# Altium schematic sheet ESP32 Sheet.SchDoc
size A2; SheetNumber: 1; SheetTotal: 1
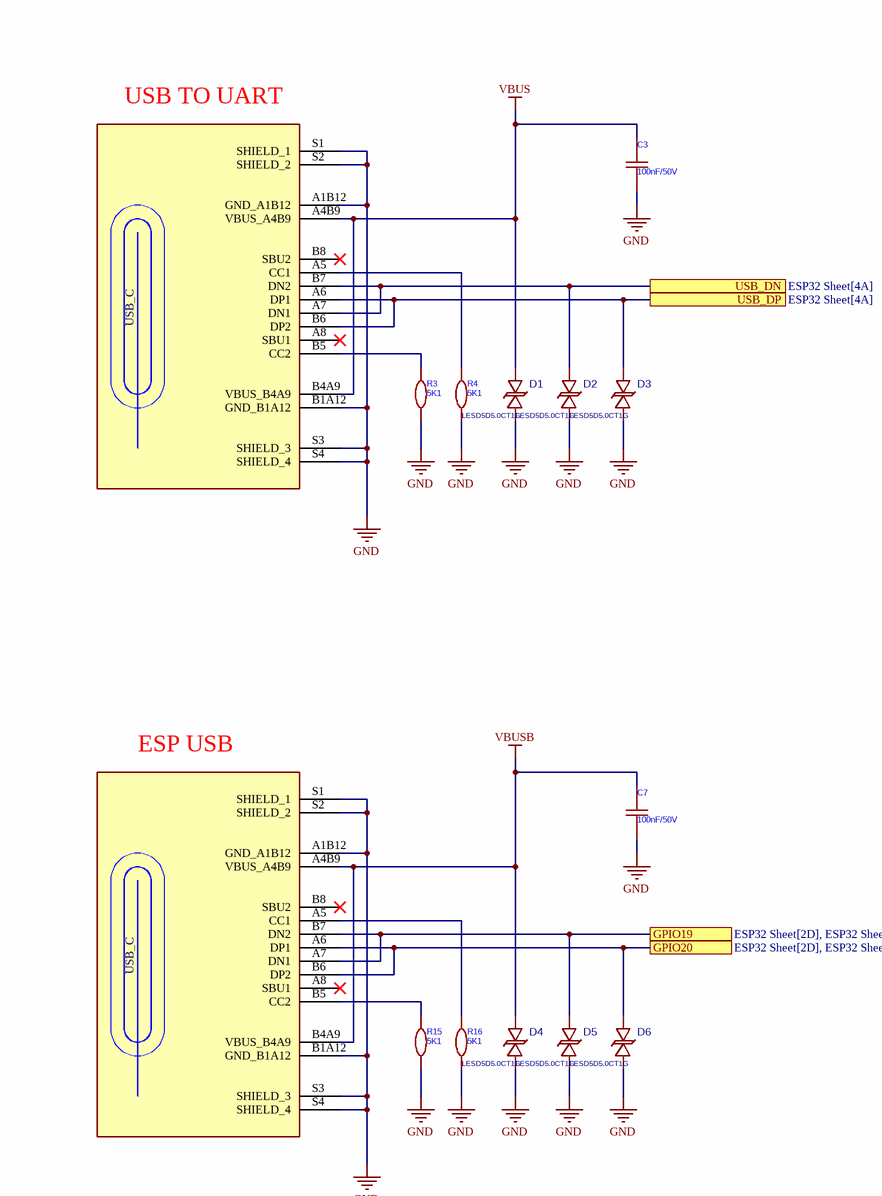
[diagram p0: ESP32 Sheet.SchDoc, top left]
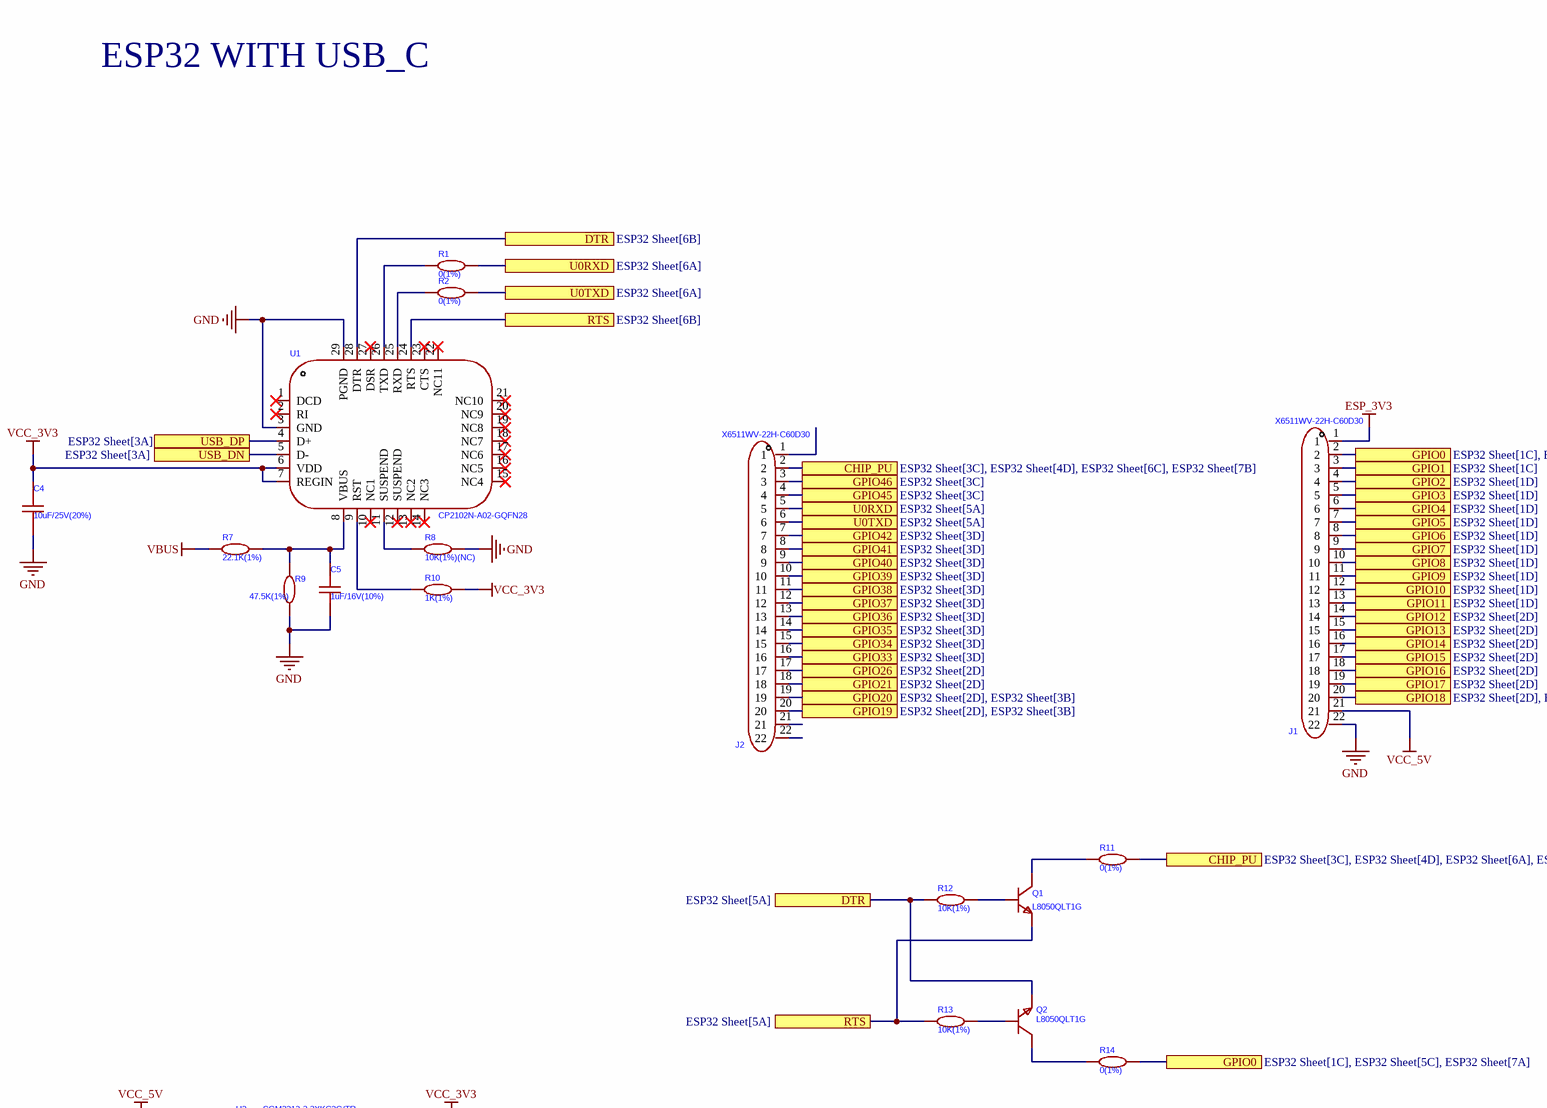
[diagram p1: ESP32 Sheet.SchDoc, top right]
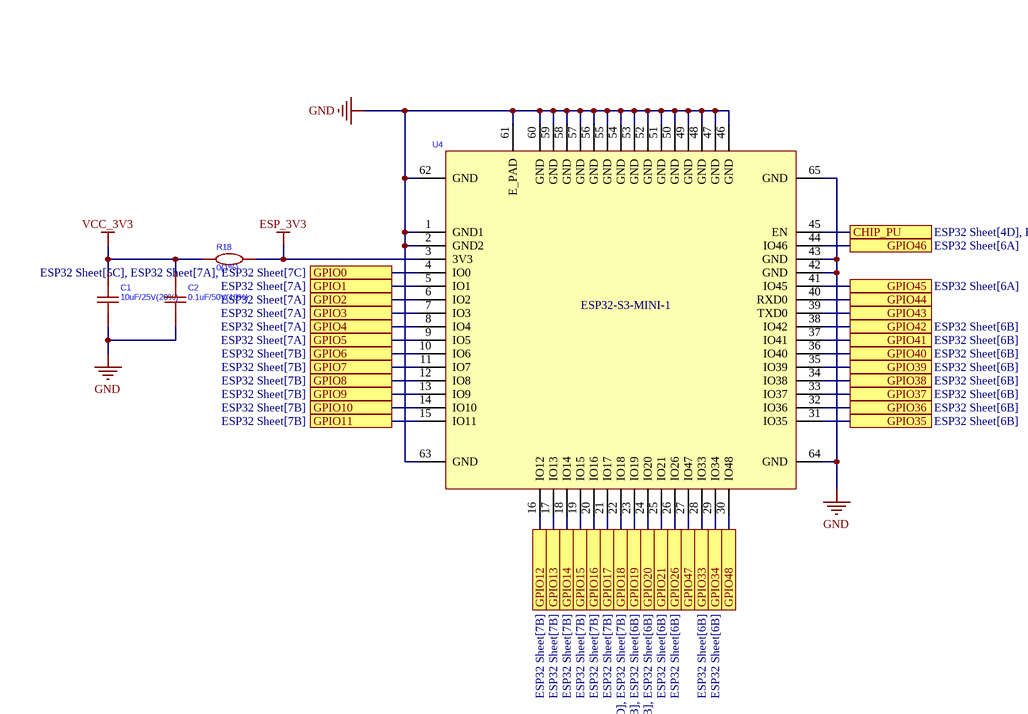
[diagram p2: ESP32 Sheet.SchDoc, bottom left]
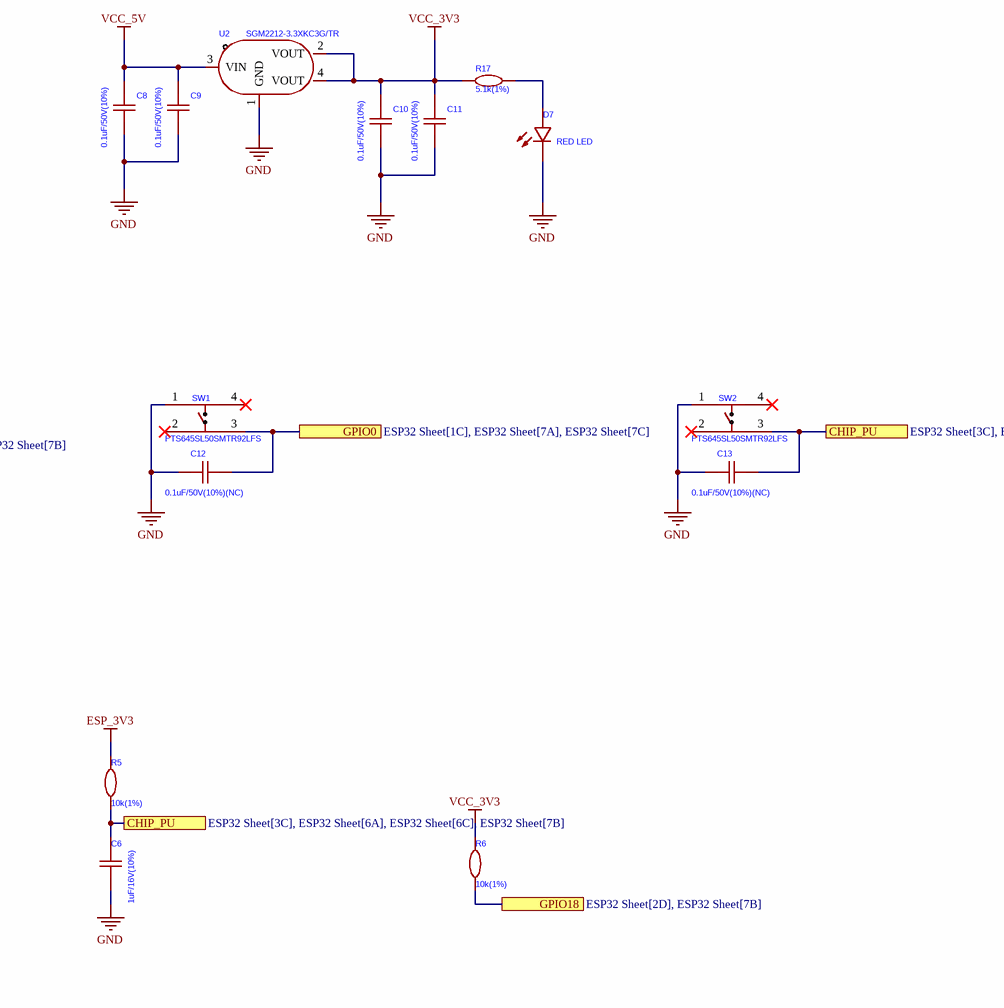
[diagram p3: ESP32 Sheet.SchDoc, bottom right]

## Parts
C1  10uF/25V(20%)  [C0402]
C2  0.1uF/50V(10%)  [C0402]
C3  100nF/50V  [C0402]
C4  10uF/25V(20%)  [C0402]
C5  1uF/16V(10%)  [C0402]
C6  1uF/16V(10%)  [C0402]
C7  100nF/50V  [C0402]
C8  0.1uF/50V(10%)  [C0402]
C9  0.1uF/50V(10%)  [C0402]
C10  0.1uF/50V(10%)  [C0402]
C11  0.1uF/50V(10%)  [C0402]
C12  0.1uF/50V(10%)(NC)  [C0402]
C13  0.1uF/50V(10%)(NC)  [C0402]
D1  LESD5D5.0CT1G  [SOD-523_L1.2-W0.8-LS1.6-BI]
D2  LESD5D5.0CT1G  [SOD-523_L1.2-W0.8-LS1.6-BI]
D3  LESD5D5.0CT1G  [SOD-523_L1.2-W0.8-LS1.6-BI]
D4  LESD5D5.0CT1G  [SOD-523_L1.2-W0.8-LS1.6-BI]
D5  LESD5D5.0CT1G  [SOD-523_L1.2-W0.8-LS1.6-BI]
D6  LESD5D5.0CT1G  [SOD-523_L1.2-W0.8-LS1.6-BI]
D7  RED LED  [LED0402-R-RD]
J1  X6511WV-22H-C60D30  [HDR-TH_22P-P2.54-V-M]
J2  X6511WV-22H-C60D30  [HDR-TH_22P-P2.54-V-M]
Q1  L8050QLT1G  [SOT-23-3_L2.9-W1.3-P1.90-LS2.4-BR]
Q2  L8050QLT1G  [SOT-23-3_L2.9-W1.3-P1.90-LS2.4-BR]
R1  0(1%)  [R0402]
R2  0(1%)  [R0402]
R3  5K1  [R0402]
R4  5K1  [R0402]
R5  10k(1%)  [R0402]
R6  10k(1%)  [R0402]
R7  22.1K(1%)  [R0402]
R8  10K(1%)(NC)  [R0402]
R9  47.5K(1%)  [R0402]
R10  1K(1%)  [R0402]
R11  0(1%)  [R0402]
R12  10K(1%)  [R0402]
R13  10K(1%)  [R0402]
R14  0(1%)  [R0402]
R15  5K1  [R0402]
R16  5K1  [R0402]
R17  5.1k(1%)  [R0402]
R18  0(1%)  [R0402]
SW1  PTS645SL50SMTR92LFS  [KEY-SMD_4P-L6.0-W6.0-P4.50-LS9.0]
SW2  PTS645SL50SMTR92LFS  [KEY-SMD_4P-L6.0-W6.0-P4.50-LS9.0]
U1  CP2102N-A02-GQFN28  [QFN-28_L5.0-W5.0-P0.50-TL-EP3.3]
U2  SGM2212-3.3XKC3G/TR  [SOT-223-3_L6.5-W3.4-P2.30-LS7.0-BR]
U4  2.4GHz  [BULETM-SMD_ESP32-S3-MINI-1-N8]  (value not drawn)
USB1  2171790001  [USB-C-SMD_2171790001]  (value not drawn)
USB2  2171790001  [USB-C-SMD_2171790001]  (value not drawn)

## Ports
CHIP_PU (see ESP32 Sheet[3C], ESP32 Sheet[4D], ESP32 Sheet[6A], ESP32 Sheet[6C]), CHIP_PU (see ESP32 Sheet[3C], ESP32 Sheet[4D], ESP32 Sheet[6A], ESP32 Sheet[7B]), CHIP_PU (see ESP32 Sheet[3C], ESP32 Sheet[4D], ESP32 Sheet[6C], ESP32 Sheet[7B]), CHIP_PU (see ESP32 Sheet[3C], ESP32 Sheet[6A], ESP32 Sheet[6C], ESP32 Sheet[7B]), CHIP_PU (see ESP32 Sheet[4D], ESP32 Sheet[6A], ESP32 Sheet[6C], ESP32 Sheet[7B]), DTR (see ESP32 Sheet[5A]), DTR (see ESP32 Sheet[6B]), GPIO0 (see ESP32 Sheet[1C], ESP32 Sheet[5C], ESP32 Sheet[7A]), GPIO0 (see ESP32 Sheet[1C], ESP32 Sheet[5C], ESP32 Sheet[7C]), GPIO0 (see ESP32 Sheet[1C], ESP32 Sheet[7A], ESP32 Sheet[7C]), GPIO0 (see ESP32 Sheet[5C], ESP32 Sheet[7A], ESP32 Sheet[7C]), GPIO1 (see ESP32 Sheet[1C]), GPIO1 (see ESP32 Sheet[7A]), GPIO2 (see ESP32 Sheet[1D]), GPIO2 (see ESP32 Sheet[7A]), GPIO3 (see ESP32 Sheet[1D]), GPIO3 (see ESP32 Sheet[7A]), GPIO4 (see ESP32 Sheet[1D]), GPIO4 (see ESP32 Sheet[7A]), GPIO5 (see ESP32 Sheet[1D]), GPIO5 (see ESP32 Sheet[7A]), GPIO6 (see ESP32 Sheet[1D]), GPIO6 (see ESP32 Sheet[7B]), GPIO7 (see ESP32 Sheet[1D]), GPIO7 (see ESP32 Sheet[7B]), GPIO8 (see ESP32 Sheet[1D]), GPIO8 (see ESP32 Sheet[7B]), GPIO9 (see ESP32 Sheet[1D]), GPIO9 (see ESP32 Sheet[7B]), GPIO10 (see ESP32 Sheet[1D]), GPIO10 (see ESP32 Sheet[7B]), GPIO11 (see ESP32 Sheet[1D]), GPIO11 (see ESP32 Sheet[7B]), GPIO12 (see ESP32 Sheet[2D]), GPIO12 (see ESP32 Sheet[7B]), GPIO13 (see ESP32 Sheet[2D]), GPIO13 (see ESP32 Sheet[7B]), GPIO14 (see ESP32 Sheet[2D]), GPIO14 (see ESP32 Sheet[7B]), GPIO15 (see ESP32 Sheet[2D]), GPIO15 (see ESP32 Sheet[7B]), GPIO16 (see ESP32 Sheet[2D]), GPIO16 (see ESP32 Sheet[7B]), GPIO17 (see ESP32 Sheet[2D]), GPIO17 (see ESP32 Sheet[7B]), GPIO18 (see ESP32 Sheet[2D], ESP32 Sheet[5D]), GPIO18 (see ESP32 Sheet[2D], ESP32 Sheet[7B]), GPIO18 (see ESP32 Sheet[5D], ESP32 Sheet[7B]), GPIO19 (see ESP32 Sheet[2D], ESP32 Sheet[3B]), GPIO19 (see ESP32 Sheet[2D], ESP32 Sheet[6B]), GPIO19 (see ESP32 Sheet[3B], ESP32 Sheet[6B]), GPIO20 (see ESP32 Sheet[2D], ESP32 Sheet[3B]), GPIO20 (see ESP32 Sheet[2D], ESP32 Sheet[6B]), GPIO20 (see ESP32 Sheet[3B], ESP32 Sheet[6B]), GPIO21 (see ESP32 Sheet[2D]), GPIO21 (see ESP32 Sheet[6B]), GPIO26 (see ESP32 Sheet[2D]), GPIO26 (see ESP32 Sheet[6B]), GPIO33 (see ESP32 Sheet[3D]), GPIO33 (see ESP32 Sheet[6B]), GPIO34 (see ESP32 Sheet[3D]), GPIO34 (see ESP32 Sheet[6B]), GPIO35 (see ESP32 Sheet[3D]), GPIO35 (see ESP32 Sheet[6B]), GPIO36 (see ESP32 Sheet[3D]), GPIO36 (see ESP32 Sheet[6B]), GPIO37 (see ESP32 Sheet[3D]), GPIO37 (see ESP32 Sheet[6B]), GPIO38 (see ESP32 Sheet[3D]), GPIO38 (see ESP32 Sheet[6B]), GPIO39 (see ESP32 Sheet[3D]), GPIO39 (see ESP32 Sheet[6B]), GPIO40 (see ESP32 Sheet[3D]), GPIO40 (see ESP32 Sheet[6B]), GPIO41 (see ESP32 Sheet[3D]), GPIO41 (see ESP32 Sheet[6B]), GPIO42 (see ESP32 Sheet[3D]), GPIO42 (see ESP32 Sheet[6B]), GPIO43, GPIO44, GPIO45 (see ESP32 Sheet[3C]), GPIO45 (see ESP32 Sheet[6A]), GPIO46 (see ESP32 Sheet[3C]), GPIO46 (see ESP32 Sheet[6A]), GPIO47, GPIO48, RTS (see ESP32 Sheet[5A]), RTS (see ESP32 Sheet[6B]), U0RXD (see ESP32 Sheet[5A]), U0RXD (see ESP32 Sheet[6A]), U0TXD (see ESP32 Sheet[5A]), U0TXD (see ESP32 Sheet[6A]), USB_DN (see ESP32 Sheet[3A]), USB_DN (see ESP32 Sheet[4A]), USB_DP (see ESP32 Sheet[3A]), USB_DP (see ESP32 Sheet[4A])

## Nets
ESP_3V3: J1.1 R5.2 R18.1 U4.3(3V3)
GND: C1.1 C2.1 C3.2 C4.2 C5.2 C6.2 C7.2 C8.1 C9.1 C10.1 C11.1 C12.1 C13.1 D1.1 D2.1 D3.1 D4.1 D5.1 D6.1 D7.2(-) J1.22 R3.1 R4.1 R8.1 R9.1 R15.1 R16.1 SW1.1 SW2.1 U1.3(GND) U1.29(PGND) U2.1(GND) U4.1(GND1) U4.2(GND2) U4.42(GND) U4.43(GND) U4.46(GND) U4.47(GND) U4.48(GND) U4.49(GND) U4.50(GND) U4.51(GND) U4.52(GND) U4.53(GND) U4.54(GND) U4.55(GND) U4.56(GND) U4.57(GND) U4.58(GND) U4.59(GND) U4.60(GND) U4.61(E_PAD) U4.62(GND) U4.63(GND) U4.64(GND) U4.65(GND) USB1.A1B12(GND_A1B12) USB1.B1A12(GND_B1A12) USB1.S1(SHIELD_1) USB1.S2(SHIELD_2) USB1.S3(SHIELD_3) USB1.S4(SHIELD_4) USB2.A1B12(GND_A1B12) USB2.B1A12(GND_B1A12) USB2.S1(SHIELD_1) USB2.S2(SHIELD_2) USB2.S3(SHIELD_3) USB2.S4(SHIELD_4)
VBUS: C3.1 D1.2 R7.2 USB1.A4B9(VBUS_A4B9) USB1.B4A9(VBUS_B4A9)
VBUSB: C7.1 D4.2 USB2.A4B9(VBUS_A4B9) USB2.B4A9(VBUS_B4A9)
VCC_3V3: C1.2 C2.2 C4.1 C10.2 C11.2 R6.2 R10.1 R17.2 R18.2 U1.6(VDD) U1.7(REGIN) U2.2(VOUT) U2.4(VOUT)
VCC_5V: C8.2 C9.2 J1.21 U2.3(VIN)
CHIP_PU: C6.1 C13.2 J2.2 R5.1 R11.1 SW2.3 U4.45(EN) ; port CHIP_PU
DTR: Q2.2(E) R12.2 U1.28(DTR) ; port DTR
GPIO0: C12.2 J1.2 R14.1 SW1.3 U4.4(IO0) ; port GPIO0
GPIO1: J1.3 U4.5(IO1) ; port GPIO1
GPIO2: J1.4 U4.6(IO2) ; port GPIO2
GPIO3: J1.5 U4.7(IO3) ; port GPIO3
GPIO4: J1.6 U4.8(IO4) ; port GPIO4
GPIO5: J1.7 U4.9(IO5) ; port GPIO5
GPIO6: J1.8 U4.10(IO6) ; port GPIO6
GPIO7: J1.9 U4.11(IO7) ; port GPIO7
GPIO8: J1.10 U4.12(IO8) ; port GPIO8
GPIO9: J1.11 U4.13(IO9) ; port GPIO9
GPIO10: J1.12 U4.14(IO10) ; port GPIO10
GPIO11: J1.13 U4.15(IO11) ; port GPIO11
GPIO12: J1.14 U4.16(IO12) ; port GPIO12
GPIO13: J1.15 U4.17(IO13) ; port GPIO13
GPIO14: J1.16 U4.18(IO14) ; port GPIO14
GPIO15: J1.17 U4.19(IO15) ; port GPIO15
GPIO16: J1.18 U4.20(IO16) ; port GPIO16
GPIO17: J1.19 U4.21(IO17) ; port GPIO17
GPIO18: J1.20 R6.1 U4.22(IO18) ; port GPIO18
GPIO19: D5.2 J2.20 U4.23(IO19) USB2.A7(DN1) USB2.B7(DN2) ; port GPIO19
GPIO20: D6.2 J2.19 U4.24(IO20) USB2.A6(DP1) USB2.B6(DP2) ; port GPIO20
GPIO21: J2.18 U4.25(IO21) ; port GPIO21
GPIO26: J2.17 U4.26(IO26) ; port GPIO26
GPIO33: J2.16 U4.28(IO33) ; port GPIO33
GPIO34: J2.15 U4.29(IO34) ; port GPIO34
GPIO35: J2.14 U4.31(IO35) ; port GPIO35
GPIO36: J2.13 U4.32(IO36) ; port GPIO36
GPIO37: J2.12 U4.33(IO37) ; port GPIO37
GPIO38: J2.11 U4.34(IO38) ; port GPIO38
GPIO39: J2.10 U4.35(IO39) ; port GPIO39
GPIO40: J2.9 U4.36(IO40) ; port GPIO40
GPIO41: J2.8 U4.37(IO41) ; port GPIO41
GPIO42: J2.7 U4.38(IO42) ; port GPIO42
GPIO43: U4.39(TXD0) ; port GPIO43
GPIO44: U4.40(RXD0) ; port GPIO44
GPIO45: J2.4 U4.41(IO45) ; port GPIO45
GPIO46: J2.3 U4.44(IO46) ; port GPIO46
GPIO47: U4.27(IO47) ; port GPIO47
GPIO48: U4.30(IO48) ; port GPIO48
RTS: Q1.2(E) R13.2 U1.24(RTS) ; port RTS
U0RXD: J2.5 R1.1 ; port U0RXD
U0TXD: J2.6 R2.1 ; port U0TXD
USB_DN: D2.2 U1.5(D-) USB1.A7(DN1) USB1.B7(DN2) ; port USB_DN
USB_DP: D3.2 U1.4(D+) USB1.A6(DP1) USB1.B6(DP2) ; port USB_DP
NetC5_1: C5.1 R7.1 R9.2 U1.8(VBUS)
NetD7_1: D7.1(+) R17.1
NetQ1_1: Q1.1(B) R12.1
NetQ1_3: Q1.3(C) R11.2
NetQ2_1: Q2.1(B) R13.1
NetQ2_3: Q2.3(C) R14.2
NetR1_2: R1.2 U1.26(TXD)
NetR2_2: R2.2 U1.25(RXD)
NetR3_2: R3.2 USB1.B5(CC2)
NetR4_2: R4.2 USB1.A5(CC1)
NetR8_2: R8.2 U1.11(SUSPEND)
NetR10_2: R10.2 U1.9(RST)
NetR15_2: R15.2 USB2.B5(CC2)
NetR16_2: R16.2 USB2.A5(CC1)

Not connected (* = marked no-connect by the designer): J2 1 21 22; SW1 2* 4*; SW2 2* 4*; U1 1(DCD)* 2(RI)* 10(NC1)* 12(SUSPEND)* 13(NC2)* 14(NC3)* 15(NC4)* 16(NC5)* 17(NC6)* 18(NC7)* 19(NC8)* 20(NC9)* 21(NC10)* 22(NC11)* 23(CTS)* 27(DSR)*; USB1 A8(SBU1)* B8(SBU2)*; USB2 A8(SBU1)* B8(SBU2)*

## Notes on the sheet
- ESP32 WITH USB_C
- USB TO UART
- ESP USB
- (in symbol 2171790001) USB_C
- (in symbol ESP32-S3-MINI-1-N8) ESP32-S3-MINI-1

## Library data of the parts
C1 C3 C4 C7 = CL05B104KB54PNC: Manufacturer: SAMSUNG(三星); Add into BOM: yes; Value: 100nF; Tolerance: ±10%; Symbol: CL05B104KB54PNC; Device: CL05B104KB54PNC; LCSC Part Name: 100nF ±10% 50V; Supplier Part: C307331; Manufacturer Part: CL05B104KB54PNC; Supplier Footprint: 0402; JLCPCB Part Class: Basic Part; Datasheet: https://atta.szlcsc.com/upload/public/pdf/source/20160218/1457707763339.pdf; Supplier: LCSC; Convert to PCB: yes
C2 C5 C6 C8-C13 = CL05B104KB54PNC: Manufacturer: SAMSUNG(三星); Add into BOM: yes; Value: 100nF; Symbol: CL05B104KB54PNC; Device: CL05B104KB54PNC; LCSC Part Name: 100nF ±10% 50V; Supplier Part: C307331; Manufacturer Part: CL05B104KB54PNC; Supplier Footprint: 0402; JLCPCB Part Class: Basic Part; Datasheet: https://atta.szlcsc.com/upload/public/pdf/source/20160218/1457707763339.pdf; Supplier: LCSC; Convert to PCB: yes; Tolerance: ±10%
D1-D6 = LESD5D5.0CT1G_C5199850: Manufacturer: UMW(友台半导体); Contributor: lcsc; Convert to PCB: Yes; Supplier: LCSC; Supplier Part: C5199850; Manufacturer Part: LESD5D5.0CT1G; JLCPCB Part Class: Extended Part; Add into BOM: Yes; spicePre: D; spiceSymbolName: LESD5D5.0CT1G_C5199850
D7 = 16-213SDRC/S530-A3/TR8: Manufacturer: EVERLIGHT(亿光); Symbol: 16-213/SDRC/S530-A3/TR8; Add into BOM: yes; Forward Voltage (VF): 2V; Forward Current: 20mA; Dominant Wavelength: 639nm; Peak Wavelength: 650nm; Lens Color: Colorless transparent lens; Luminous Intensity: 43mcd; Viewing Angle: 120°; Device: 16-213SDRC/S530-A3/TR8; LCSC Part Name: 红灯; Supplier Part: C71911; Manufacturer Part: 16-213SDRC/S530-A3/TR8; Supplier Footprint: 0402; JLCPCB Part Class: Extended Part; Datasheet: https://atta.szlcsc.com/upload/public/pdf/source/20180423/C71911_C51F85E8EEDEC443F292EE02E8E26750.pdf; Supplier: LCSC; Convert to PCB: yes; Emitted Color: Red
J1 J2 = X6511WV-22H-C60D30: Manufacturer: XKB Connection(中国星坤); Symbol: X6511WV-22H-C30D60; Add into BOM: yes; Pin Structure: 1x22P; Pitch: 2.54mm; Circluar Pins/Square Pins: Policy; Current Rating: 3A; Voltage Rating (Max): 250V; Device: X6511WV-22H-C60D30; LCSC Part Name: 1x22P 间距:2.54mm 方针; Supplier Part: C725954; Manufacturer Part: X6511WV-22H-C60D30; Supplier Footprint: 插件,P=2.54mm; JLCPCB Part Class: Extended Part; Datasheet: https://atta.szlcsc.com/upload/public/pdf/source/20221108/2FDDF9C694C8EDC81165E23F2EAAE597.pdf; Supplier: LCSC; Convert to PCB: yes; Row Spacing: 2.54mm; Number of Rows: Single Row; Number of Pins: 22P; Length of Mating Pin: -; Insulation Height: 2.5mm; Length of End Connection Pin: -; Contact Material: Brass; Contact Plating: Gold; Operating Temperature: -40℃~+105℃; Color: Black
Q1 Q2 = L8050QLT1G: Manufacturer: LRC(乐山无线电); Add into BOM: yes; DC Current Gain (hFE@Ic,Vce): 100@100mA,1V; Collector Cut-Off Current (Icbo): 150nA; Collector-Emitter Saturation Voltage (VCE(sat)@Ic,Ib): 500mV@800mA,80mA; Symbol: L8050QLT1G; Device: L8050QLT1G; LCSC Part Name: NPN 电流:800mA 耐压:25V; Supplier Part: C49581; Manufacturer Part: L8050QLT1G; Supplier Footprint: SOT-23; JLCPCB Part Class: Extended Part; Datasheet: https://atta.szlcsc.com/upload/public/pdf/source/20150518/1457707314424.pdf; Supplier: LCSC; Convert to PCB: yes; Operating Temperature: -55℃~+150℃
R1 R2 R5-R14 R17 R18 = AC0402FR-0710KL: Manufacturer: YAGEO(国巨); Add into BOM: yes; Value: 10kΩ; Temperature Coefficient: ±100ppm/℃; Symbol: AC0402FR-0710KL; Device: AC0402FR-0710KL; LCSC Part Name: 厚膜电阻 10kΩ ±1% 62.5mW; Supplier Part: C144807; Manufacturer Part: AC0402FR-0710KL; Supplier Footprint: 0402; JLCPCB Part Class: Extended Part; Datasheet: https://atta.szlcsc.com/upload/public/pdf/source/20180927/C229861_4ABDC471507C1ED6AFB4BA66AFC8620A.pdf; Supplier: LCSC; Convert to PCB: yes; Type: Thick Film Resistors; Tolerance: ±1%; Operating Temperature Range: -55℃~+155℃
R3 R4 R15 R16 = AC0402FR-0710KL: Manufacturer: YAGEO(国巨); Add into BOM: yes; Value: 10kΩ; Tolerance: ±1%; Temperature Coefficient: ±100ppm/℃; Symbol: AC0402FR-0710KL; Device: AC0402FR-0710KL; LCSC Part Name: 厚膜电阻 10kΩ ±1% 62.5mW; Supplier Part: C144807; Manufacturer Part: AC0402FR-0710KL; Supplier Footprint: 0402; JLCPCB Part Class: Extended Part; Datasheet: https://atta.szlcsc.com/upload/public/pdf/source/20180927/C229861_4ABDC471507C1ED6AFB4BA66AFC8620A.pdf; Supplier: LCSC; Convert to PCB: yes; Type: Thick Film Resistors; Operating Temperature Range: -55℃~+155℃
SW1 SW2 = PTS645SL50SMTR92LFS: Manufacturer: C&K; Add into BOM: yes; Circuit: SPST; Actuator Style: Round Button; Operating Force: 130gf; Switch Length: 6mm; Switch Height: 1.55mm; Contact Current: 50mA; Voltage Rating (DC): 12V; Pin Style: Gull Wing; Symbol: PTS645SL50SMTR92LFS; Device: PTS645SL50SMTR92LFS; LCSC Part Name: 6*6*1.55mm 立贴 轻触开关; Supplier Part: C221877; Manufacturer Part: PTS645SL50SMTR92LFS; Supplier Footprint: SMD; JLCPCB Part Class: Extended Part; Datasheet: https://atta.szlcsc.com/upload/public/pdf/source/20190108/C285530_E89B379DE8DD14E424006A6061D0203A.pdf; Supplier: LCSC; Convert to PCB: yes; Mounting Style: Brick nogging; Switch Width: 6mm; With Lamp: -; Mechanical Life: -; Operating Temperature: -40℃~+85℃
U1 = CP2102N-A02-GQFN28: Manufacturer: SKYWORKS/SILICON LABS(芯科); Add into BOM: yes; Applications Function: USB to UART; Voltage - Supply: 3V~3.6V; Symbol: CP2102N-A02-GQFN28; Device: CP2102N-A02-GQFN28; LCSC Part Name: CP2102N-A02-GQFN28; Supplier Part: C1550553; Manufacturer Part: CP2102N-A02-GQFN28; Supplier Footprint: QFN-28-EP(5x5); JLCPCB Part Class: Extended Part; Datasheet: https://atta.szlcsc.com/upload/public/pdf/source/20201204/C964632_F2B790CC23A72455AEF523510305B30A.pdf; Supplier: LCSC; Convert to PCB: yes; Protocol: -; Operating Temperature: -40℃~+85℃@(Ta)
U2 = SGM2212-3.3XKC3G/TR_C3294699: Manufacturer: SGMICRO(圣邦微); Add into BOM: yes; Symbol: SGM2212-3.3XKC3G/TR_C3294699; Device: SGM2212-3.3XKC3G/TR_C3294699; LCSC Part Name: SGM2212-3.3XKC3G/TR; Supplier Part: C3294699; Manufacturer Part: SGM2212-3.3XKC3G/TR; Supplier Footprint: SOT-223-3; JLCPCB Part Class: Extended Part; Supplier: LCSC; Convert to PCB: yes
U4 = ESP32-S3-MINI-1-N8: Manufacturer: ESPRESSIF(乐鑫); Add into BOM: yes; Core Processor: ESP32-S3FN8 Chip; Support Interface: I2C；GPIO；SPI；PWM；ADC；UART；USB；I2S; Output Power: 20.5dBm; Symbol: ESP32-S3-MINI-1-N8; Device: ESP32-S3-MINI-1-N8; LCSC Part Name: ESP32-S3-MINI-1-N8; Supplier Part: C2913206; Manufacturer Part: ESP32-S3-MINI-1-N8; Supplier Footprint: SMD; JLCPCB Part Class: Extended Part; Datasheet: https://atta.szlcsc.com/upload/public/pdf/source/20220425/7F117D7A09F85946280540FD9EFDF9F3.pdf; Supplier: LCSC; Convert to PCB: yes; Wireless Standard: -; Value: 2.4GHz; Antenna Type: -; Operating Voltage: -; Receive  Current: -; Send  Current: -; Sensitivity: -; Operating Temperature: -
USB1 USB2 = 2171790001: Manufacturer: MOLEX; Add into BOM: yes; Symbol: 2171790001; Device: 2171790001; LCSC Part Name: 2171790001; Supplier Part: C3197684; Manufacturer Part: 2171790001; Supplier Footprint: SMD; JLCPCB Part Class: Extended Part; Datasheet: https://www.molex.com/content/dam/molex/molex-dot-com/products/automated/en-us/salesdrawingpdf/217/217179/2171790001_sd.pdf?inline\; Supplier: LCSC; Convert to PCB: yes